# Altium project UZ_A_MAX11331.PrjPCB (part 2 of 3)

## Sheet Power_Supply_1.SchDoc
size A4; Author: Andreas Geiger; CompanyName: Technische Hochschule Nürnberg Georg Simon Ohm; Organization: UltraZohm; Address1: Kesslerplatz 12; Address2: 90489 Nürnberg; Address3: GERMANY; DocumentNumber: 10; SheetNumber: 10; SheetTotal: 12; Website: www.ultrazohm.com
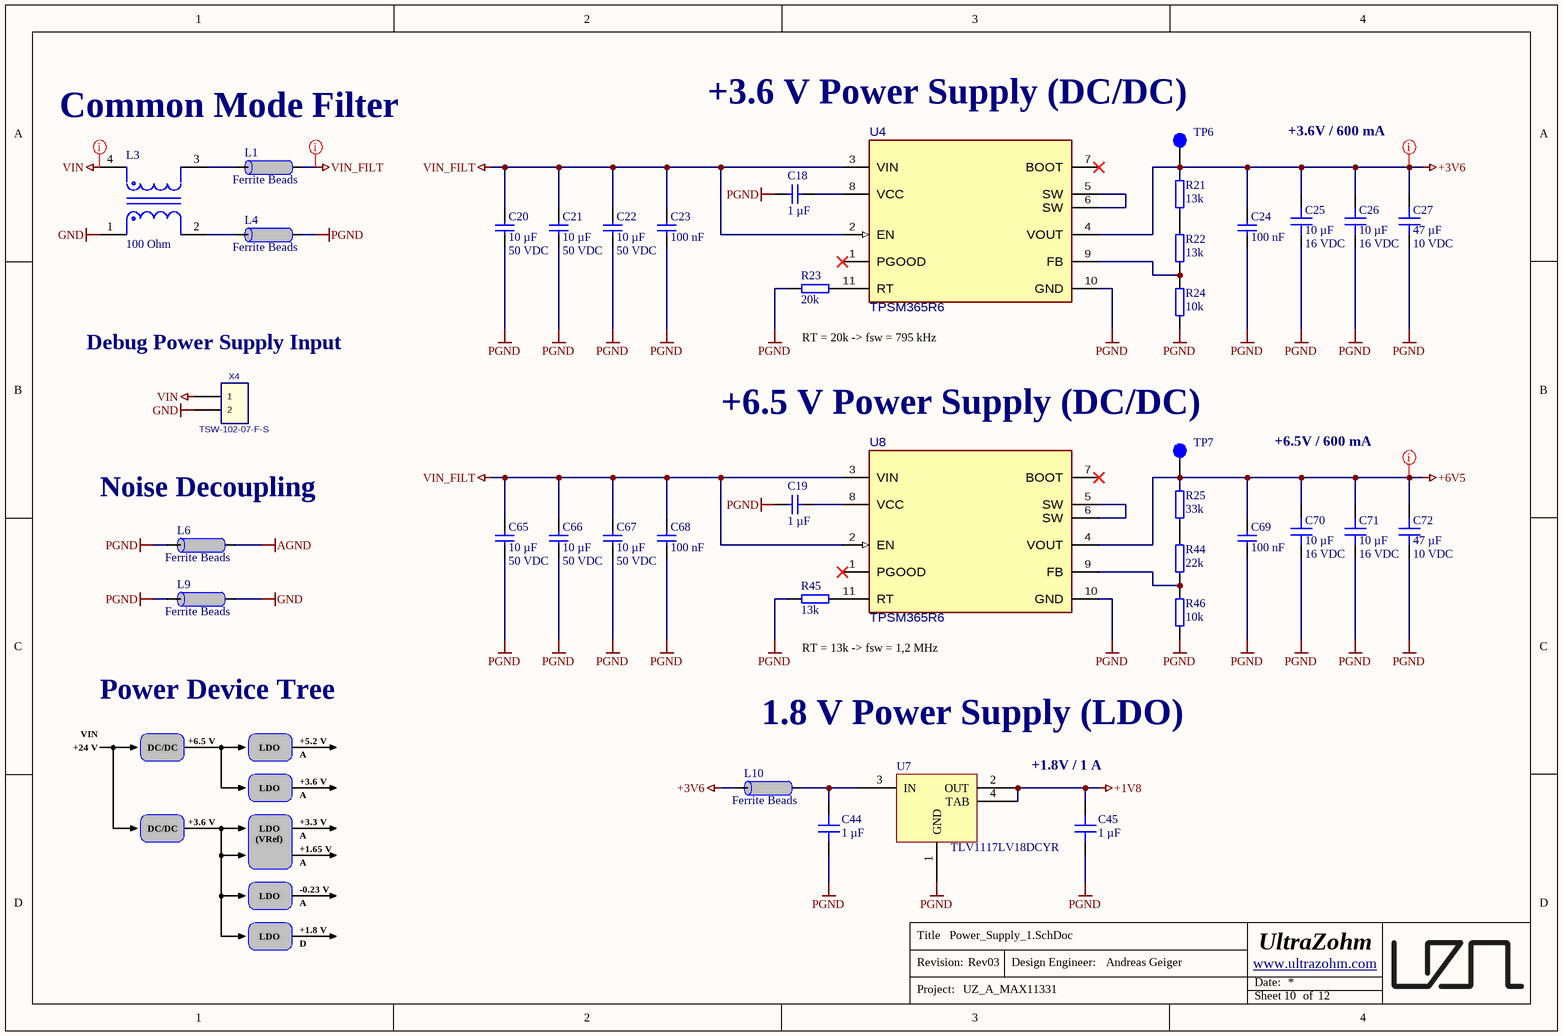
[diagram p7: Power_Supply_1.SchDoc]

### Parts
C18  1 µF  [C_0603_TE]
C19  1 µF  [C_0603_TE]
C20  10 µF  Voltage Rating: 50 VDC  [C_1206_TE]
C21  10 µF  Voltage Rating: 50 VDC  [C_1206_TE]
C22  10 µF  Voltage Rating: 50 VDC  [C_1206_TE]
C23  100 nF  [C_0603_TE]
C24  100 nF  [C_0603_TE]
C25  10 µF  Voltage Rating: 16 VDC  [C_0603_TE]
C26  10 µF  Voltage Rating: 16 VDC  [C_0603_TE]
C27  47 µF  Voltage Rating: 10 VDC  [C_1210_N]
C44  1 µF  [C_0603]
C45  1 µF  [C_0603]
C65  10 µF  Voltage Rating: 50 VDC  [C_1206_TE]
C66  10 µF  Voltage Rating: 50 VDC  [C_1206_TE]
C67  10 µF  Voltage Rating: 50 VDC  [C_1206_TE]
C68  100 nF  [C_0603_TE]
C69  100 nF  [C_0603_TE]
C70  10 µF  Voltage Rating: 16 VDC  [C_0603_TE]
C71  10 µF  Voltage Rating: 16 VDC  [C_0603_TE]
C72  47 µF  Voltage Rating: 10 VDC  [C_1210_N]
L1  Component Type: Ferrite Beads  [INDC2012X92N_V]  (hidden comment: UPZ2012E601-2R0TF)
L3  100 Ohm  [FP-DLW5BT-MFG]
L4  Component Type: Ferrite Beads  [INDC2012X92N_V]  (hidden comment: UPZ2012E601-2R0TF)
L6  Component Type: Ferrite Beads  [INDC2012X92N_V]  (hidden comment: UPZ2012E601-2R0TF)
L9  Component Type: Ferrite Beads  [INDC2012X92N_V]  (hidden comment: UPZ2012E601-2R0TF)
L10  Component Type: Ferrite Beads  [INDC2012X92N_V]  (hidden comment: UPZ2012E601-2R0TF)
R21  13k  [R_0402_TE]
R22  13k  [R_0402_TE]
R23  20k  [R_0402_TE]
R24  10k  [R_0402_TE]
R25  33k  [R_0402_TE]
R44  22k  [R_0402_TE]
R45  13k  [R_0402_TE]
R46  10k  [R_0402_TE]
TP6  Testpoint 1mm  [TP_1mm]  (value not drawn)  (no BOM)
TP7  Testpoint 1mm  [TP_1mm]  (value not drawn)  (no BOM)
U4  TPSM365R6  [RDN0011A-MFG]
U7  TLV1117LV18DCYR  [SOT230P700X170-4N]
U8  TPSM365R6  [RDN0011A-MFG]
X4  TSW-102-07-F-S  [TSW-102-XX-XXX-S]

### Nets
+1V8: C45.2 U7.2(OUT) U7.4(TAB)
+3V6: C24.2 C25.2 C26.2 C27.2 L10.2 R21.2 TP6.1 U4.4(VOUT)
+6V5: C69.2 C70.2 C71.2 C72.2 R25.2 TP7.1 U8.4(VOUT)
AGND: L6.1
GND: L3.1 L9.1 X4.2
PGND: C18.1 C19.1 C20.2 C21.2 C22.2 C23.1 C24.1 C25.1 C26.1 C27.1 C44.1 C45.1 C65.1 C66.1 C67.1 C68.1 C69.1 C70.1 C71.1 C72.1 L4.1 L6.2 L9.2 R23.1 R24.1 R45.1 R46.1 U4.10(GND) U7.1(GND) U8.10(GND)
VIN: L3.4 X4.1
VIN_FILT: C20.1 C21.1 C22.1 C23.2 C65.2 C66.2 C67.2 C68.2 L1.1 U4.2(EN) U4.3(VIN) U8.2(EN) U8.3(VIN)
NetC18_2: C18.2 U4.8(VCC)
NetC19_2: C19.2 U8.8(VCC)
NetC44_2: C44.2 L10.1 U7.3(IN)
NetL1_2: L1.2 L3.3
NetL3_2: L3.2 L4.2
NetR21_1: R21.1 R22.2
NetR22_1: R22.1 R24.2 U4.9(FB)
NetR23_2: R23.2 U4.11(RT)
NetR25_1: R25.1 R44.2
NetR44_1: R44.1 R46.2 U8.9(FB)
NetR45_2: R45.2 U8.11(RT)
NetU4_5: U4.5(SW) U4.6(SW)
NetU8_5: U8.5(SW) U8.6(SW)

Not connected (* = marked no-connect by the designer): U4 1(PGOOD)* 7(BOOT)*; U8 1(PGOOD)* 7(BOOT)*

### Layout directives
net class PWR: +3V6, +6V5, VIN, VIN_FILT

### Notes on the sheet
- (near TP6) +3.6 V Power Supply (DC/DC)
- Common Mode Filter
- +3.6V / 600 mA
- (near X4) Debug Power Supply Input
- RT = 20k -> fsw = 795 kHz
- (near TP7) +6.5 V Power Supply (DC/DC)
- +6.5V / 600 mA
- Noise Decoupling
- Power Device Tree
- RT = 13k -> fsw = 1,2 MHz
- +24 V
- VIN
- DC/DC
- +6.5 V
- LDO
- +5.2 V
- +3.6 V
- A
- 1.8 V Power Supply (LDO)
- +1.8V / 1 A
- (VRef)
- +1.65 V
- +3.3 V
- -0.23 V
- +1.8 V
- D
- Title
- Revision:
- Design Engineer:
- Date:
- Project:
- Sheet
- of

### Library data of the parts
C18 C19 = UZgen_C_0603_1uF_16V_X7R: Generic capacitor; Manufacturer: UZgen; Voltage: 16V; Tolerance: 10 %; Created from: UZgenTool; Technology: X7R; Value: 1 µF; Manufacturer Part Number: UZgen_C_0603_1uF_16V_X7R; PartID: 3783; Created On: 02.08.2024 11:17:59; Device Package: 0603; Mounting Type: SMD; Last Updated: 02.08.2024 11:17:59
C20-C22 C65-C67 = CL31B106KBHNNNE: 50V 10uF X7R ±10% 1206  Multilayer Ceramic Capacitors MLCC - SMD/SMT ROHS; Manufacturer: Samsung Electro-Mechanics; Created from: AGeiger; Manufacturer Part Number: CL31B106KBHNNNE; PartID: 107; Created On: 20.09.2022 20:14:50; ComponentLink1Description: Datasheet; ComponentLink1URL: https://datasheet.lcsc.com/lcsc/1810221111_Samsung-Electro-Mechanics-CL31B106KBHNNNE_C89632.pdf; Component Type: Capacitor 1206; Device Package: 1206; Last Updated: 08.08.2024 12:57:34; Mounting Type: SMD; Operating Temperature: -55 - 125°C; Series: X7R; Supplier 1: LCSC; Supplier Part Number 1: C89632; Type: Capacitor; Tolerance: 10 %; Value: 10 µF; Live Cycle Status: 1; LCSC Part Number: C89632; Supplier 2: Mouser; Supplier Part Number 2: 187-CL31B106KBHNNNE
C23 C24 C68 C69 = UZgen_C_0603_100nF_50V_X7R: as C82 on sheet CarrierConnector; Manufacturer Part Number: UZgen_C_0603_100nF_50V_X7R; PartID: 1; Created On: 02.07.2024 14:42:23; Device Package: 0603; Last Updated: 08.08.2024 15:01:15; Mounting Type: SMD; Value: 100 nF; Technology: X7R
C25 C26 C70 C71 = CL10A106MO8NQNC: Capacitor 0603, 16 VDC, 10 µF, X5R; Manufacturer: Samsung Electro-Mechanics; Tolerance: 20 %; Created from: AGeiger; Manufacturer Part Number: CL10A106MO8NQNC; PartID: 101; Created On: 22.08.2022 13:56:44; ComponentLink1Description: Datasheet; ComponentLink1URL: https://datasheet.lcsc.com/lcsc/1810261909_Samsung-Electro-Mechanics-CL10A106MO8NQNC_C92487.pdf; Component Type: Capacitor 0603; Device Package: 0603; Last Updated: 19.11.2024 12:34:06; Mounting Type: SMD; Operating Temperature: -55 - 85°C; Supplier 1: LCSC; Supplier Part Number 1: C92487; Type: Capacitor; Value: 10 µF; Live Cycle Status: 1; LCSC Part Number: C92487; Series: X5R
C27 C72 = GRM32ER71A476KE15L: 10V 47uF X7R ±10% 1210  Multilayer Ceramic Capacitors MLCC - SMD/SMT ROHS; Manufacturer: Murata Electronics; Created from: AGeiger; Manufacturer Part Number: GRM32ER71A476KE15L; PartID: 111; Created On: 21.09.2022 16:18:50; ComponentLink1Description: Datasheet; ComponentLink1URL: https://datasheet.lcsc.com/lcsc/1811071031_Murata-Electronics-GRM32ER71A476KE15L_C84494.pdf; Component Type: Capacitor 1210; Device Package: 1210; Last Updated: 21.09.2022 16:18:50; Mounting Type: SMD; Operating Temperature: -55 - 125°C; Series: GRM; Supplier 1: LCSC; Supplier Part Number 1: C84494; Type: Capacitor; Tolerance: 10 %; Value: 47 µF; Live Cycle Status: 1; LCSC Part Number: C84494
C44 C45 = UMK107AB7105KA-T: 50V 1uF X7R ±10% 0603 Multilayer Ceramic Capacitors MLCC - SMD/SMT ROHS; Manufacturer: Taiyo Yuden; Voltage Rating: 50 VDC; Created from: NDiringer; Manufacturer Part Number: UMK107AB7105KA-T; PartID: 98; Created On: 09.08.2022 09:35:02; ComponentLink1Description: Datasheet; ComponentLink1URL: https://www.mouser.de/datasheet/2/396/mlcc02_e-1307760.pdf; Component Type: Capacitor 0603; Device Package: 0603; Last Updated: 21.09.2022 16:11:37; Mounting Type: SMD; Operating Temperature: -55 - 125°C; Series: X7R; Supplier 1: LCSC; Supplier Part Number 1: C105174; Supplier 2: Mouser; Supplier Part Number 2: 963-UMK107AB7105MA-T; Type: Capacitor; Tolerance: 10 %; Value: 1 µF; Live Cycle Status: 1; LCSC Part Number: C105174; Stock number: not stored
L1 L4 L6 L9 L10 = UPZ2012E601-2R0TF: 2A 1 90mΩ 600Ω@100MHz ±25% 0805  Ferrite Beads ROHS; Manufacturer: Sunlord; Value: 90 Ohm; Created from: AGeiger; Manufacturer Part Number: UPZ2012E601-2R0TF; PartID: 11; Created On: 03.09.2022 16:57:01; ComponentLink1Description: Datasheet; ComponentLink1URL: https://datasheet.lcsc.com/lcsc/2110091730_Sunlord-UPZ2012E601-2R0TF_C98308.pdf; Device Package: 0805; Last Updated: 03.09.2022 17:01:04; Mounting Type: SMD; Operating Temperature: -55 - 125 °C; Supplier 1: LCSC; Supplier Part Number 1: C98308; Type: Ferrite Bead; DC current: 2 A; Live Cycle Status: 1; LCSC Part Number: C98308
L3 = DLW5BTH142TQ2L: -40℃~125℃ 1.5A 56mΩ 50V 100Ω @ 10MHz 125VDC SMD,5x5mm Common Mode Filters ROHS; Manufacturer: Murata; Type: Common Mode Choke; Created from: AGeiger; Manufacturer Part Number: DLW5BTH142TQ2L; PartID: 13; Created On: 18.10.2022 16:07:46; ComponentLink1Description: Datasheet; ComponentLink1URL: https://datasheet.lcsc.com/lcsc/1912111437_Murata-Electronics-DLW5BTH142TQ2L_C393166.pdf; Component Type: Common Mode Choke; Device Package: SMD,5x5mm; Last Updated: 14.08.2025 08:46:24; Mounting Type: SMD; Operating Temperature: -40 to +125 °C; Series: DLW; Supplier 1: LCSC; Supplier Part Number 1: C393166; DC current: 1.5A; Value: 100 Ohm; Live Cycle Status: 1; LCSC Part Number: C393166
R21 R22 R45 = UZgen_R_0402_13k: Generic resistor; Manufacturer: UZgen; Tolerance: 1 %; Created from: UZgenTool; Manufacturer Part Number: UZgen_R_0402_13k; PartID: 104; Created On: 02.07.2024 17:29:46; Value: 13k; Device Package: 0402; Mounting Type: SMD; Last Updated: 02.07.2024 17:29:46
R23 = UZgen_R_0402_20k: Generic resistor; Manufacturer: UZgen; Tolerance: 1 %; Created from: UZgenTool; Manufacturer Part Number: UZgen_R_0402_20k; PartID: 108; Created On: 02.07.2024 17:29:46; Value: 20k; Device Package: 0402; Mounting Type: SMD; Last Updated: 02.07.2024 17:29:46
R24 R46 = UZgen_R_0402_10k: Generic resistor; Manufacturer: UZgen; Tolerance: 1 %; Created from: UZgenTool; Manufacturer Part Number: UZgen_R_0402_10k; PartID: 101; Created On: 02.07.2024 17:29:46; Value: 10k; Device Package: 0402; Mounting Type: SMD; Last Updated: 02.07.2024 17:29:46
R25 = UZgen_R_0402_33k: Generic resistor; Manufacturer: UZgen; Tolerance: 1 %; Created from: UZgenTool; Manufacturer Part Number: UZgen_R_0402_33k; PartID: 113; Created On: 02.07.2024 17:29:47; Value: 33k; Device Package: 0402; Mounting Type: SMD; Last Updated: 02.07.2024 17:29:47
R44 = UZgen_R_0402_22k: Generic resistor; Manufacturer: UZgen; Tolerance: 1 %; Created from: UZgenTool; Manufacturer Part Number: UZgen_R_0402_22k; PartID: 109; Created On: 02.07.2024 17:29:46; Value: 22k; Device Package: 0402; Mounting Type: SMD; Last Updated: 02.07.2024 17:29:46
TP6 TP7 = Testpoint_1mm: Manufacturer: UltraZohm; Created from: AGeiger; Created: 2018_06_25_AGeiger; Value: Testpoint 1mm; Manufacturer Part Number: Testpoint_1mm; PartID: 9; Created On: 20.09.2022 13:14:57; Component Type: Testpoint; Last Updated: 14.08.2025 11:47:07; Supplier 1: NULL; Supplier Part Number 1: NULL; Type: Testpoint; Live Cycle Status: 1
U4 U8 = TPSM365R6FRDNR: 3-V to 65-V input, 1-V to 13-V output, 0.6-A synchronous buck converter power module; Manufacturer: Texas Instruments; Created from: AGeiger; Manufacturer Part Number: TPSM365R6FRDNR; PartID: 42; Created On: 16.06.2025 17:12:20; ComponentLink1Description: Datasheet; ComponentLink1URL: https://www.ti.com/lit/ds/symlink/tpsm365r3.pdf?ts=1747982141267; Component Type: Power module with inductor; Device Package: QFN-FCMOD; Last Updated: 26.09.2025 12:26:17; Mounting Type: SMD; Operating Temperature: -40 to +125 °C; Series: TPSM365; Supplier 1: LCSC; Supplier Part Number 1: C6723000; Type: Power module (integrated inductor); Value: TPSM365R6; Live Cycle Status: 1; LCSC Part Number: C6723000; Stock number: not stored; Supplier 2: Mouser; Supplier Part Number 2: 595-TPSM365R6FRDNR
U7 = TLV1117LV18DCYR: 1-A, Positive Fixed-Voltage, Low-Dropout Regulator; MF: Texas Instruments; Voltage Output: 1.8 V; Voltage Input Max: 5.5 V; Current Max: 1 A; Value: 1.8V; Created from: AGeiger; MPN: TLV1117LV18DCYR; Supplier 1: LCSC; Supplier Part Number 1: C80105; Manufacturer Part Number: TLV1117LV18DCYR; PartID: 23; Created On: 28.11.2022 16:53:03; ComponentLink1Description: Datasheet; ComponentLink1URL: https://www.ti.com/lit/ds/symlink/tlv1117lv.pdf?HQS=dis-mous-null-mousermode-dsf-pf-null-wwe&ts=1669592607754&ref_url=https%253A%252F%252Fwww.mouser.de%252F; Component Type: Low Dropout Regulator; Device Package: SOT-223; Last Updated: 28.11.2022 16:53:03; Manufacturer: Texas Instruments; Mounting Type: SMD; Operating Temperature: -40 to +125 °C; Type: Low Dropout Regulator; Live Cycle Status: 1; LCSC Part Number: C80105; Stock number: not stored
X4 = TSW-102-07-F-S: Pin Header, 2.54mm, 2x1; MANUFACTURER: SAMTEC; Created from: AGeiger; Number of positions: 2; CREATED BY: May 18, 2016 - Wendy Xin; PCB DECAL: TSW-102-XX-XXX-S; Manufacturer Part Number: TSW-102-07-F-S; PartID: 13; Created On: 02.12.2022 15:20:24; ComponentLink1Description: Datasheet; ComponentLink1URL: https://suddendocs.samtec.com/catalog_english/tsw_th.pdf; Component Type: Pin Header; Device Package: THT; Last Updated: 02.12.2022 15:20:30; Mounting Type: THT; Operating Temperature: -55 to +125 °C; Series: TSW; Supplier 1: Mouser; Supplier Part Number 1: 200-TSW10207FS; Type: Pin Header; Live Cycle Status: 1; Stock number: not stored; Number of rows: 1

## Sheet ADC_Signal_Distribution.SchDoc
size A4; Author: Andreas Geiger; CompanyName: Technische Hochschule Nürnberg Georg Simon Ohm; Organization: UltraZohm; Address1: Kesslerplatz 12; Address2: 90489 Nürnberg; Address3: GERMANY; DocumentNumber: 8; SheetNumber: 8; SheetTotal: 12; Website: www.ultrazohm.com
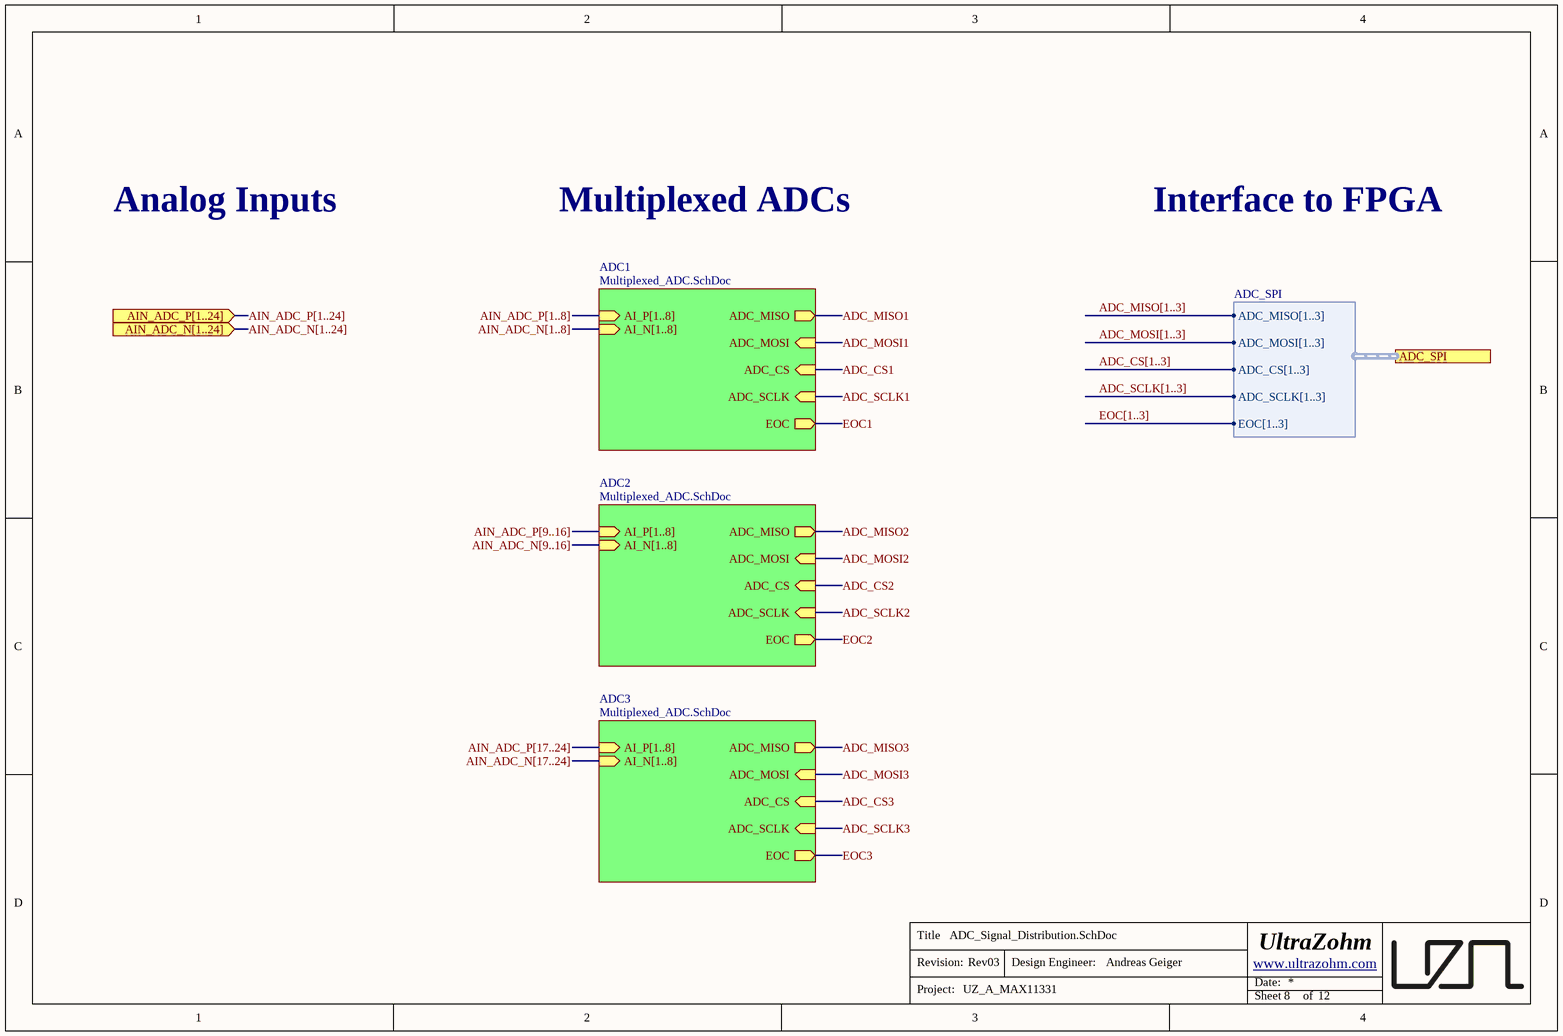
[diagram p8: ADC_Signal_Distribution.SchDoc]

### Sub-sheets
ADC1 = Multiplexed_ADC.SchDoc: ADC_MOSI (in), ADC_CS (in), ADC_SCLK (in), ADC_MISO (out), AI_P[1..8] (in), AI_N[1..8] (in), EOC (out)
ADC2 = Multiplexed_ADC.SchDoc: ADC_MOSI (in), ADC_CS (in), ADC_SCLK (in), ADC_MISO (out), AI_P[1..8] (in), AI_N[1..8] (in), EOC (out)
ADC3 = Multiplexed_ADC.SchDoc: ADC_MOSI (in), ADC_CS (in), ADC_SCLK (in), ADC_MISO (out), AI_P[1..8] (in), AI_N[1..8] (in), EOC (out)

### Ports
ADC_SPI (harness ADC_SPI), AIN_ADC_N[1..24] (in), AIN_ADC_P[1..24] (in)

### Harnesses
ADC_SPI: ADC_MISO[1..3], ADC_MOSI[1..3], ADC_CS[1..3], ADC_SCLK[1..3], EOC[1..3]

### Buses and harness runs
bus ADC_CS[1..3]
bus ADC_MISO[1..3]
bus ADC_MOSI[1..3]
bus ADC_SCLK[1..3]
bus AIN_ADC_N[1..8] = sheet ADC1/AI_N[1..8]
bus AIN_ADC_N[1..24] = port AIN_ADC_N[1..24]
bus AIN_ADC_N[9..16] = sheet ADC2/AI_N[1..8]
bus AIN_ADC_N[17..24] = sheet ADC3/AI_N[1..8]
bus AIN_ADC_P[1..8] = sheet ADC1/AI_P[1..8]
bus AIN_ADC_P[1..24] = port AIN_ADC_P[1..24]
bus AIN_ADC_P[9..16] = sheet ADC2/AI_P[1..8]
bus AIN_ADC_P[17..24] = sheet ADC3/AI_P[1..8]
bus EOC[1..3]

### Notes on the sheet
- Analog Inputs
- Multiplexed ADCs
- Interface to FPGA
- Title
- Revision:
- Design Engineer:
- Date:
- Project:
- Sheet
- of

## Sheet Multiplexed_ADC.SchDoc
size A4; Author: Andreas Geiger; CompanyName: Technische Hochschule Nürnberg Georg Simon Ohm; Organization: UltraZohm; Address1: Kesslerplatz 12; Address2: 90489 Nürnberg; Address3: GERMANY; DocumentNumber: 9; SheetNumber: 9; SheetTotal: 12; Website: www.ultrazohm.com
Used 3 times, as channels U_ADC_Signal_Distribution/ADC1, U_ADC_Signal_Distribution/ADC2, U_ADC_Signal_Distribution/ADC3. Parts and nets are listed once, with the designators drawn on the sheet.
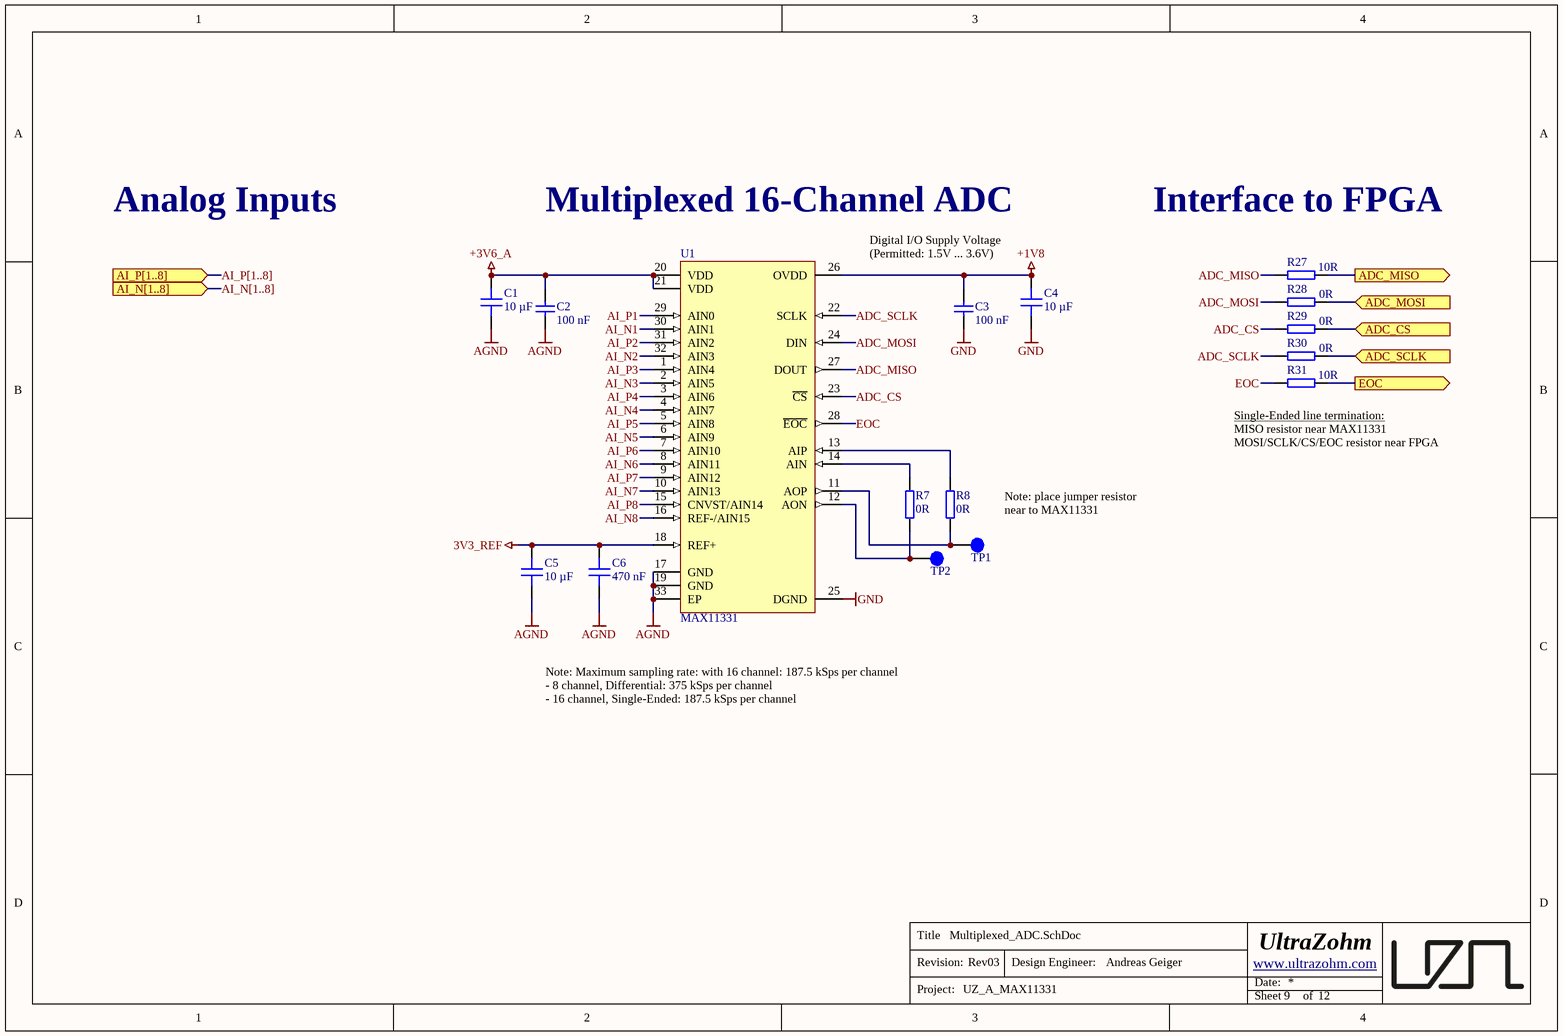
[diagram p9: Multiplexed_ADC.SchDoc]

### Parts
C1  10 µF  [C_0603_TE]
C2  100 nF  [C_0603_TE]
C3  100 nF  [C_0603_TE]
C4  10 µF  [C_0603_TE]
C5  10 µF  [C_0603_TE]
C6  470 nF  [C_0603]
R7  0R  [R_0603_TE]
R8  0R  [R_0603_TE]
R27  10R  [R_0402_TE]
R28  0R  [R_0402_TE]
R29  0R  [R_0402_TE]
R30  0R  [R_0402_TE]
R31  10R  [R_0402_TE]
TP1  Testpoint 1mm  [TP_1mm]  (value not drawn)  (no BOM)
TP2  Testpoint 1mm  [TP_1mm]  (value not drawn)  (no BOM)
U1  MAX11331  [QFN50P500X500X80-33N-310]

### Ports
ADC_CS (in), ADC_MISO (out), ADC_MOSI (in), ADC_SCLK (in), AI_N[1..8] (in), AI_P[1..8] (in), EOC (out)

### Nets
3V3_REF: C5.2 C6.2 U1.18(REF+)
+1V8: C3.2 C4.2 U1.26(OVDD)
+3V6_A: C1.2 C2.2 U1.20(VDD) U1.21(VDD)
AGND: C1.1 C2.1 C5.1 C6.1 U1.17(GND) U1.19(GND) U1.33(EP)
GND: C3.1 C4.1 U1.25(DGND)
ADC_CS: R29.1 U1.23(~{CS})
ADC_CS: R29.2 ; port ADC_CS  [a separate net that carries the same name]
ADC_MISO: R27.1 U1.27(DOUT)
ADC_MISO: R27.2 ; port ADC_MISO  [a separate net that carries the same name]
ADC_MOSI: R28.1 U1.24(DIN)
ADC_MOSI: R28.2 ; port ADC_MOSI  [a separate net that carries the same name]
ADC_SCLK: R30.1 U1.22(SCLK)
ADC_SCLK: R30.2 ; port ADC_SCLK  [a separate net that carries the same name]
AI_N1: U1.30(AIN1)
AI_N2: U1.32(AIN3)
AI_N3: U1.2(AIN5)
AI_N4: U1.4(AIN7)
AI_N5: U1.6(AIN9)
AI_N6: U1.8(AIN11)
AI_N7: U1.10(AIN13)
AI_N8: U1.16(REF-/AIN15)
AI_P1: U1.29(AIN0)
AI_P2: U1.31(AIN2)
AI_P3: U1.1(AIN4)
AI_P4: U1.3(AIN6)
AI_P5: U1.5(AIN8)
AI_P6: U1.7(AIN10)
AI_P7: U1.9(AIN12)
AI_P8: U1.15(CNVST/AIN14)
EOC: R31.1 U1.28(~{EOC})
EOC: R31.2 ; port EOC  [a separate net that carries the same name]
NetR7_1: R7.1 TP2.1 U1.12(AON)
NetR7_2: R7.2 U1.14(AIN)
NetR8_1: R8.1 TP1.1 U1.11(AOP)
NetR8_2: R8.2 U1.13(AIP)

### Channels
U_ADC_Signal_Distribution/ADC1: designators end in A; ports ADC_CS=ADC_CS1 ADC_MISO=ADC_MISO1 ADC_MOSI=ADC_MOSI1 ADC_SCLK=ADC_SCLK1 EOC=EOC1
U_ADC_Signal_Distribution/ADC2: designators end in B; ports ADC_CS=ADC_CS2 ADC_MISO=ADC_MISO2 ADC_MOSI=ADC_MOSI2 ADC_SCLK=ADC_SCLK2 EOC=EOC2
U_ADC_Signal_Distribution/ADC3: designators end in C; ports ADC_CS=ADC_CS3 ADC_MISO=ADC_MISO3 ADC_MOSI=ADC_MOSI3 ADC_SCLK=ADC_SCLK3 EOC=EOC3

### Buses and harness runs
bus AI_N[1..8] = port AI_N[1..8]
bus AI_P[1..8] = port AI_P[1..8]

### Notes on the sheet
- Analog Inputs
- Multiplexed 16-Channel ADC
- Digital I/O Supply Voltage
- Interface to FPGA
- (Permitted: 1.5V ... 3.6V)
- (near R31) Single-Ended line termination:
- (near R31) MISO resistor near MAX11331
- MOSI/SCLK/CS/EOC resistor near FPGA
- Note: place jumper resistor
- near to MAX11331
- Note: Maximum sampling rate: with 16 channel: 187.5 kSps per channel
- - 16 channel, Single-Ended: 187.5 kSps per channel
- - 8 channel, Differential: 375 kSps per channel
- Title
- Revision:
- Design Engineer:
- Date:
- Project:
- Sheet
- of

### Library data of the parts
C1 C4 C5 = CL10A106MO8NQNC: Capacitor 0603, 16 VDC, 10 µF, X5R; Manufacturer: Samsung Electro-Mechanics; Tolerance: 20 %; Voltage Rating: 16 VDC; Created from: AGeiger; Manufacturer Part Number: CL10A106MO8NQNC; PartID: 101; Created On: 22.08.2022 13:56:44; ComponentLink1Description: Datasheet; ComponentLink1URL: https://datasheet.lcsc.com/lcsc/1810261909_Samsung-Electro-Mechanics-CL10A106MO8NQNC_C92487.pdf; Component Type: Capacitor 0603; Device Package: 0603; Last Updated: 19.11.2024 12:34:06; Mounting Type: SMD; Operating Temperature: -55 - 85°C; Supplier 1: LCSC; Supplier Part Number 1: C92487; Type: Capacitor; Value: 10 µF; Live Cycle Status: 1; LCSC Part Number: C92487; Series: X5R
C2 C3 = UZgen_C_0603_100nF_50V_X7R: as C82 on sheet CarrierConnector; Manufacturer Part Number: UZgen_C_0603_100nF_50V_X7R; PartID: 1; Created On: 02.07.2024 14:42:23; Device Package: 0603; Last Updated: 08.08.2024 15:01:15; Mounting Type: SMD; Value: 100 nF; Technology: X7R
C6 = CL10A474KB8NNNC: Capacitor 0603, 50 VDC, 470 nF, X5R; Manufacturer: Samsung Electro-Mechanics; Tolerance: 10 %; Voltage Rating: 50 VDC; Created from: AGeiger; Manufacturer Part Number: CL10A474KB8NNNC; PartID: 103; Created On: 22.08.2022 14:44:45; ComponentLink1Description: Datasheet; ComponentLink1URL: https://datasheet.lcsc.com/lcsc/1810191213_Samsung-Electro-Mechanics-CL10A474KB8NNNC_C170149.pdf; Component Type: Capacitor 0603; Device Package: 0603; Last Updated: 22.08.2022 14:44:45; Mounting Type: SMD; Operating Temperature: -55 - 85°C; Supplier 1: LCSC; Supplier Part Number 1: C170149; Supplier 2: Mouser; Supplier Part Number 2: 187-CL10A474KB8NNNC; Type: Capacitor; Value: 470 nF; Live Cycle Status: 1; LCSC Part Number: C170149
R7 R8 = UZgen_R_0603_0R: Generic resistor; Manufacturer: UZgen; Tolerance: 1 %; Created from: UZgenTool; Manufacturer Part Number: UZgen_R_0603_0R; PartID: 581; Created On: 08.07.2024 14:34:30; Value: 0R; Device Package: 0603; Mounting Type: SMD; Last Updated: 08.07.2024 14:34:30
R27 R31 = UZgen_R_0402_10R: Generic resistor; Manufacturer: UZgen; Tolerance: 1 %; Created from: UZgenTool; Manufacturer Part Number: UZgen_R_0402_10R; PartID: 29; Created On: 02.07.2024 17:29:44; Device Package: 0402; Last Updated: 02.07.2024 17:29:44; Mounting Type: SMD; Value: 10R
R28-R30 = UZgen_R_0402_0R: Generic resistor; Manufacturer: UZgen; Tolerance: 1 %; Created from: UZgenTool; Manufacturer Part Number: UZgen_R_0402_0R; PartID: 580; Created On: 08.07.2024 14:34:30; Device Package: 0402; Last Updated: 08.07.2024 14:34:30; Mounting Type: SMD; Value: 0R
TP1 TP2 = Testpoint_1mm: as TP6 on sheet Power_Supply_1; Created: 2018_06_25_AGeiger; Value: Testpoint 1mm; Manufacturer Part Number: Testpoint_1mm; PartID: 9; Created On: 20.09.2022 13:14:57; Component Type: Testpoint; Last Updated: 14.08.2025 11:47:07; Supplier 1: NULL; Supplier Part Number 1: NULL; Type: Testpoint; Live Cycle Status: 1
U1 = MAX11331ATJ+: 3Msps, 12-/10-Bit, 8-/16-Channel ADCs with Post-Mux External Signal Conditioning Access; Manufacturer: Maxim Integrated; Channels: 16; Resolution: 12 bit; Created from: AGeiger; Manufacturer Part Number: MAX11331ATJ+; PartID: 4; Created On: 25.08.2022 14:24:25; ComponentLink1Description: Datasheet; ComponentLink1URL: https://datasheets.maximintegrated.com/en/ds/MAX11329-MAX11332.pdf; Component Type: ADC; Device Package: TQFN-32 EP; Last Updated: 25.08.2022 14:27:33; Mounting Type: SMD; Operating Temperature: -40 - 125 °C; Supplier 1: Mouser; Supplier Part Number 1: 700-MAX11331ATJ+; Type: ADC; Value: MAX11331; Live Cycle Status: 1; LCSC Part Number: C1543252

## Sheet Power_Supply_2.SchDoc
size A4; Author: Andreas Geiger; CompanyName: Technische Hochschule Nürnberg Georg Simon Ohm; Organization: UltraZohm; Address1: Kesslerplatz 12; Address2: 90489 Nürnberg; Address3: GERMANY; DocumentNumber: 11; SheetNumber: 11; SheetTotal: 12; Website: www.ultrazohm.com
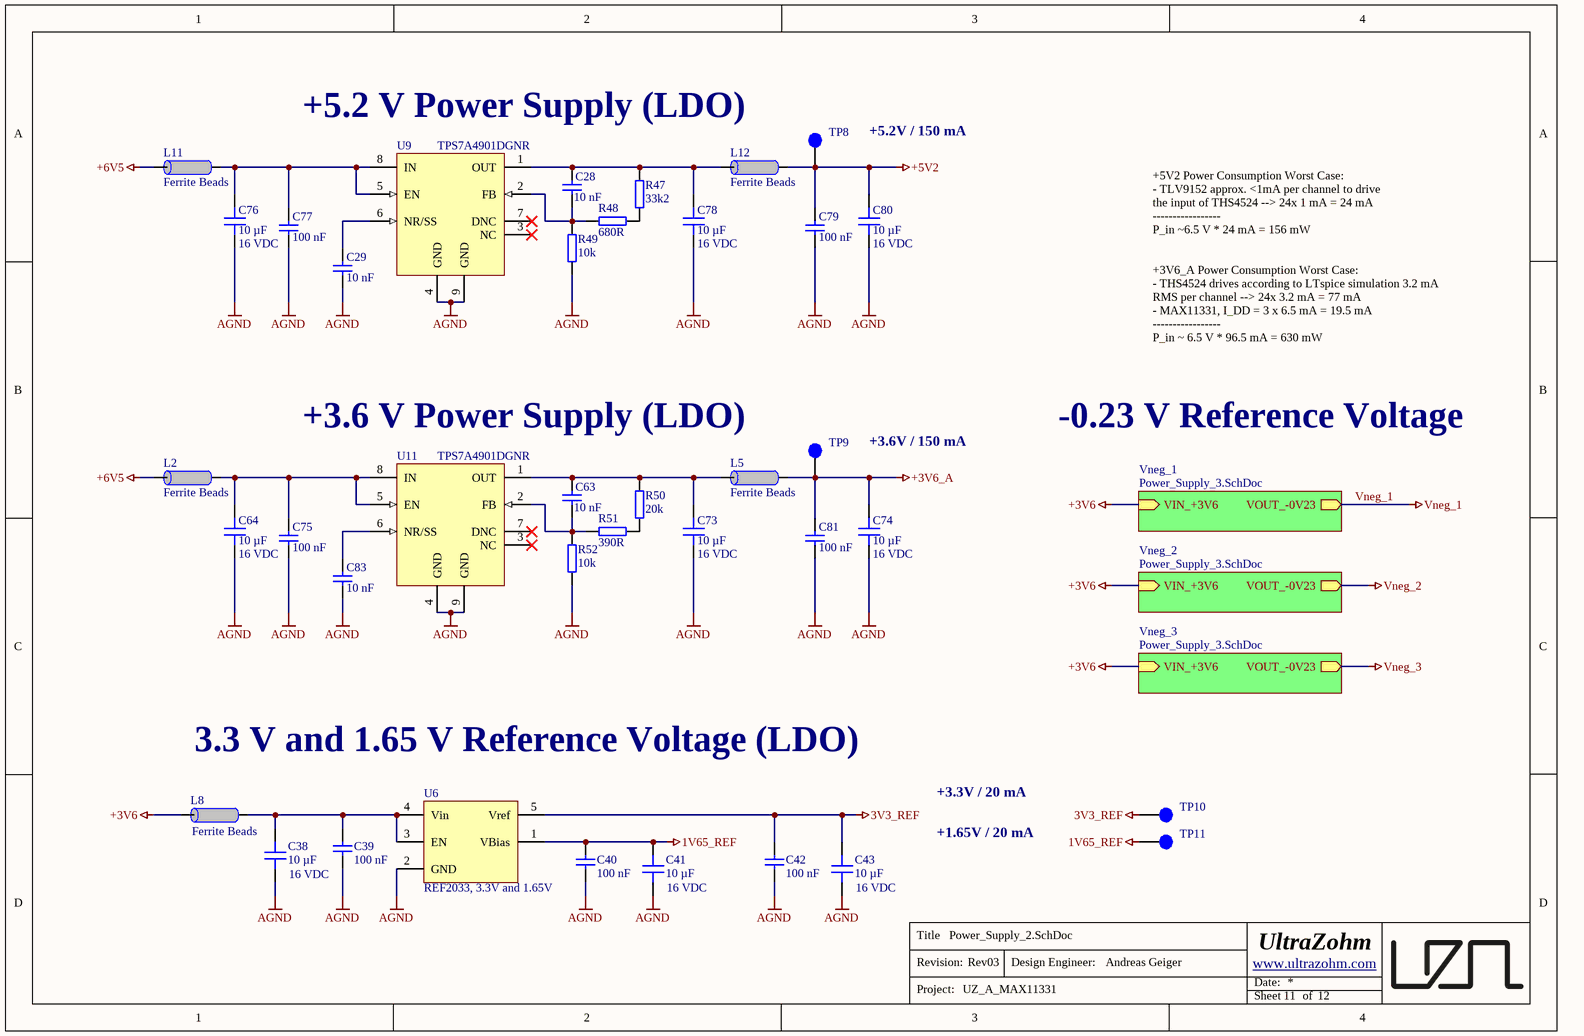
[diagram p10: Power_Supply_2.SchDoc]

### Parts
C28  10 nF  [C_0402_TE]
C29  10 nF  [C_0402_TE]
C38  10 µF  Voltage Rating: 16 VDC  [C_0603_TE]
C39  100 nF  [C_0603_TE]
C40  100 nF  [C_0603_TE]
C41  10 µF  Voltage Rating: 16 VDC  [C_0603_TE]
C42  100 nF  [C_0603_TE]
C43  10 µF  Voltage Rating: 16 VDC  [C_0603_TE]
C63  10 nF  [C_0402_TE]
C64  10 µF  Voltage Rating: 16 VDC  [C_0603_TE]
C73  10 µF  Voltage Rating: 16 VDC  [C_0603_TE]
C74  10 µF  Voltage Rating: 16 VDC  [C_0603_TE]
C75  100 nF  [C_0603_TE]
C76  10 µF  Voltage Rating: 16 VDC  [C_0603_TE]
C77  100 nF  [C_0603_TE]
C78  10 µF  Voltage Rating: 16 VDC  [C_0603_TE]
C79  100 nF  [C_0603_TE]
C80  10 µF  Voltage Rating: 16 VDC  [C_0603_TE]
C81  100 nF  [C_0603_TE]
C83  10 nF  [C_0402_TE]
L2  Component Type: Ferrite Beads  [INDC2012X92N_V]  (hidden comment: UPZ2012E601-2R0TF)
L5  Component Type: Ferrite Beads  [INDC2012X92N_V]  (hidden comment: UPZ2012E601-2R0TF)
L8  Component Type: Ferrite Beads  [INDC2012X92N_V]  (hidden comment: UPZ2012E601-2R0TF)
L11  Component Type: Ferrite Beads  [INDC2012X92N_V]  (hidden comment: UPZ2012E601-2R0TF)
L12  Component Type: Ferrite Beads  [INDC2012X92N_V]  (hidden comment: UPZ2012E601-2R0TF)
R47  33k2  [R_0402_TE]
R48  680R  [R_0402_TE]
R49  10k  [R_0402_TE]
R50  20k  [R_0402_TE]
R51  390R  [R_0402_TE]
R52  10k  [R_0402_TE]
TP8  Testpoint 1mm  [TP_1mm]  (value not drawn)  (no BOM)
TP9  Testpoint 1mm  [TP_1mm]  (value not drawn)  (no BOM)
TP10  Testpoint 1mm  [TP_1mm]  (value not drawn)  (no BOM)
TP11  Testpoint 1mm  [TP_1mm]  (value not drawn)  (no BOM)
U6  REF2033, 3.3V and 1.65V  [SOT23-5_N]
U9  TPS7A4901DGNR  [SOP65P490X110-9N]
U11  TPS7A4901DGNR  [SOP65P490X110-9N]

### Sub-sheets
Vneg_1 = Power_Supply_3.SchDoc: VIN_+3V6 (in), VOUT_-0V23 (out)
Vneg_2 = Power_Supply_3.SchDoc: VIN_+3V6 (in), VOUT_-0V23 (out)
Vneg_3 = Power_Supply_3.SchDoc: VIN_+3V6 (in), VOUT_-0V23 (out)

### Nets
1V65_REF: C40.2 C41.2 TP11.1 U6.1(VBias)
3V3_REF: C42.2 C43.2 TP10.1 U6.5(Vref)
+3V6: L8.2 ; sheet Vneg_1/VIN_+3V6, sheet Vneg_2/VIN_+3V6, sheet Vneg_3/VIN_+3V6
+3V6_A: C74.2 C81.2 L5.1 TP9.1
+5V2: C79.2 C80.2 L12.1 TP8.1
+6V5: L2.2 L11.2
AGND: C29.1 C38.1 C39.1 C40.1 C41.1 C42.1 C43.1 C64.1 C73.1 C74.1 C75.1 C76.1 C77.1 C78.1 C79.1 C80.1 C81.1 C83.1 R49.1 R52.1 U6.2(GND) U9.4(GND) U9.9(GND) U11.4(GND) U11.9(GND)
NetC28_1: C28.1 R48.1 R49.2 U9.2(FB)
NetC28_2: C28.2 C78.2 L12.2 R47.2 U9.1(OUT)
NetC29_2: C29.2 U9.6(NR/SS)
NetC38_2: C38.2 C39.2 L8.1 U6.3(EN) U6.4(Vin)
NetC63_1: C63.1 R51.1 R52.2 U11.2(FB)
NetC63_2: C63.2 C73.2 L5.2 R50.2 U11.1(OUT)
NetC64_2: C64.2 C75.2 L2.1 U11.5(EN) U11.8(IN)
NetC76_2: C76.2 C77.2 L11.1 U9.5(EN) U9.8(IN)
NetC83_2: C83.2 U11.6(NR/SS)
NetR47_1: R47.1 R48.2
NetR50_1: R50.1 R51.2

Not connected (* = marked no-connect by the designer): U9 3(NC)* 7(DNC)*; U11 3(NC)* 7(DNC)*

### Notes on the sheet
- +5.2 V Power Supply (LDO)
- +5.2V / 150 mA
- +5V2 Power Consumption Worst Case:
  - TLV9152 approx. <1mA per channel to drive the input of THS4524 --> 24x 1 mA = 24 mA
  -----------------
  P_in ~6.5 V * 24 mA = 156 mW
- +3V6_A Power Consumption Worst Case:
  - THS4524 drives according to LTspice simulation 3.2 mA RMS per channel --> 24x 3.2 mA = 77 mA
  - MAX11331, I_DD = 3 x 6.5 mA = 19.5 mA
  -----------------
  P_in ~ 6.5 V * 96.5 mA = 630 mW
- +3.6 V Power Supply (LDO)
- +3.6V / 150 mA
- -0.23 V Reference Voltage
- 3.3 V and 1.65 V Reference Voltage (LDO)
- +3.3V / 20 mA
- +1.65V / 20 mA
- Title
- Revision:
- Design Engineer:
- Date:
- Project:
- Sheet
- of

### Library data of the parts
C28 C29 C63 C83 = UZgen_C_0402_10nF_50V_NP0: Generic capacitor; Manufacturer: UZgen; Voltage: 50V; Tolerance: 10 %; Created from: UZgenTool; Manufacturer Part Number: UZgen_C_0402_10nF_50V_NP0; PartID: 5709; Created On: 13.12.2024 11:08:46; Value: 10 nF; Device Package: 0402; Technology: NP0; Mounting Type: SMD; Last Updated: 13.12.2024 11:08:46
C38 C41 C43 C64 C73 C74 C76 C78 C80 = CL10A106MO8NQNC: as C25 on sheet Power_Supply_1; Manufacturer Part Number: CL10A106MO8NQNC; PartID: 101; Created On: 22.08.2022 13:56:44; ComponentLink1Description: Datasheet; ComponentLink1URL: https://datasheet.lcsc.com/lcsc/1810261909_Samsung-Electro-Mechanics-CL10A106MO8NQNC_C92487.pdf; Component Type: Capacitor 0603; Device Package: 0603; Mounting Type: SMD; Operating Temperature: -55 - 85°C; Supplier 1: LCSC; Supplier Part Number 1: C92487; Type: Capacitor; Value: 10 µF; Live Cycle Status: 1; LCSC Part Number: C92487; Series: X5R
  C38 C41 C43: Last Updated: 19.11.2024 12:34:06
  C64 C73 C74 C76 C78 C80: Last Updated: 19.11.2024 12:40:46
C39 C40 C42 C75 C77 C79 C81 = UZgen_C_0603_100nF_50V_X7R: as C82 on sheet CarrierConnector; Manufacturer Part Number: UZgen_C_0603_100nF_50V_X7R; PartID: 1; Created On: 02.07.2024 14:42:23; Device Package: 0603; Last Updated: 08.08.2024 15:01:15; Mounting Type: SMD; Value: 100 nF; Technology: X7R
L2 L5 L8 L11 L12 = UPZ2012E601-2R0TF: as L1 on sheet Power_Supply_1; Manufacturer Part Number: UPZ2012E601-2R0TF; PartID: 11; Created On: 03.09.2022 16:57:01; ComponentLink1Description: Datasheet; ComponentLink1URL: https://datasheet.lcsc.com/lcsc/2110091730_Sunlord-UPZ2012E601-2R0TF_C98308.pdf; Device Package: 0805; Last Updated: 03.09.2022 17:01:04; Mounting Type: SMD; Operating Temperature: -55 - 125 °C; Supplier 1: LCSC; Supplier Part Number 1: C98308; Type: Ferrite Bead; DC current: 2 A; Live Cycle Status: 1; LCSC Part Number: C98308
R47 = 0402WGF3322TCE: 62.5mW Thick Film Resistor 50V ±100ppm/℃ ±1% 33.2kΩ 0402 Chip Resistor - Surface Mount ROHS; Manufacturer: UNI-ROYAL; Created from: AGeiger; Value: 33k2; Tolerance: 1%; Manufacturer Part Number: 0402WGF3322TCE; PartID: 369; Created On: 08.08.2024 13:22:47; ComponentLink1Description: Datasheet; ComponentLink1URL: https://www.lcsc.com/datasheet/C122548.pdf; Component Type: SMD resistor; Device Package: 0402; Last Updated: 07.08.2025 14:20:31; Mounting Type: SMD; Supplier 1: LCSC; Supplier Part Number 1: C122548; Type: Resistor; Live Cycle Status: 1; LCSC Part Number: C122548
R48 = UZgen_R_0402_680R: Generic resistor; Manufacturer: UZgen; Tolerance: 1 %; Created from: UZgenTool; Manufacturer Part Number: UZgen_R_0402_680R; PartID: 73; Created On: 02.07.2024 17:29:46; Value: 680R; Device Package: 0402; Mounting Type: SMD; Last Updated: 02.07.2024 17:29:46
R49 R52 = UZgen_R_0402_10k: as R24 on sheet Power_Supply_1; Manufacturer Part Number: UZgen_R_0402_10k; PartID: 101; Created On: 02.07.2024 17:29:46; Value: 10k; Device Package: 0402; Mounting Type: SMD; Last Updated: 02.07.2024 17:29:46
R50 = UZgen_R_0402_20k: as R23 on sheet Power_Supply_1; Value: 20k; Manufacturer Part Number: UZgen_R_0402_20k; PartID: 108; Created On: 02.07.2024 17:29:46; Device Package: 0402; Last Updated: 02.07.2024 17:29:46; Mounting Type: SMD
R51 = UZgen_R_0402_390R: Generic resistor; Manufacturer: UZgen; Tolerance: 1 %; Created from: UZgenTool; Manufacturer Part Number: UZgen_R_0402_390R; PartID: 67; Created On: 02.07.2024 17:29:46; Value: 390R; Device Package: 0402; Mounting Type: SMD; Last Updated: 02.07.2024 17:29:46
TP8-TP11 = Testpoint_1mm: as TP6 on sheet Power_Supply_1; Created: 2018_06_25_AGeiger; Value: Testpoint 1mm; Manufacturer Part Number: Testpoint_1mm; PartID: 9; Created On: 20.09.2022 13:14:57; Component Type: Testpoint; Last Updated: 14.08.2025 11:47:07; Supplier 1: NULL; Supplier Part Number 1: NULL; Type: Testpoint; Live Cycle Status: 1
U6 = REF2033AIDDCT: REF20xx Low-Drift, Low-Power, Dual-Output, VREF and VREF / 2 Voltage References; Manufacturer: Texas Instruments; Created from: AGeiger; Digikey Part-Number: 296-40487-1-ND; Manufacturer Part Number: REF2033AIDDCT; PartID: 12; Created On: 20.09.2022 16:03:22; ComponentLink1Description: Datasheet; ComponentLink1URL: https://www.ti.com/lit/ds/symlink/ref2033.pdf?HQS=dis-mous-null-mousermode-dsf-pf-null-wwe&ts=1661952535444&ref_url=https%253A%252F%252Fwww.mouser.de%252F; Component Type: Voltage Reference; Device Package: SMD; Last Updated: 20.09.2022 16:03:22; Mounting Type: SMD; Operating Temperature: -40 - 125 °C; Series: REF20xx; Supplier 1: LCSC; Supplier Part Number 1: C181409; Type: Voltage Reference; Value: REF2033, 3.3V and 1.65V; Live Cycle Status: 1; LCSC Part Number: C181409; Stock number: not stored
U9 U11 = TPS7A4901DGNR: 36 V, -150 mA, ultralow-noise, positive linear regulator; Manufacturer: Texas Instruments; Value: -1.194 V - -33 V; Created from: AGeiger; ComponentLink1Description: Datasheet; ComponentLink1URL: https://www.ti.com/lit/ds/symlink/tps7a49.pdf?HQS=dis-mous-null-mousermode-dsf-pf-null-wwe&ts=1629794614893&ref_url=https%253A%252F%252Fwww.mouser.fr%252F; Supplier 1: Mouser; Supplier Part Number 1: 595-TPS7A4901DGNR; Supplier 2: LCSC; Supplier Part Number 2: C16430; Manufacturer Part Number: TPS7A4901DGNR; PartID: 6; Created On: 24.08.2021 11:34:06; Component Type: LDO; Device Package: HVSSOP-8; Last Updated: 11.08.2025 10:14:53; Mounting Type: SMD; Operating Temperature: -40 to +125 °C; Series: TPS7A4901; Type: LDO; Live Cycle Status: 1; Stock number: not stored; LCSC Part Number: C16430

## Sheet Power_Supply_3.SchDoc
size A4; Author: Andreas Geiger; CompanyName: Technische Hochschule Nürnberg Georg Simon Ohm; Organization: UltraZohm; Address1: Kesslerplatz 12; Address2: 90489 Nürnberg; Address3: GERMANY; DocumentNumber: 12; SheetNumber: 12; SheetTotal: 12; Website: www.ultrazohm.com
Used 3 times, as channels U_Power_Supply_2/Vneg_1, U_Power_Supply_2/Vneg_2, U_Power_Supply_2/Vneg_3. Parts and nets are listed once, with the designators drawn on the sheet.
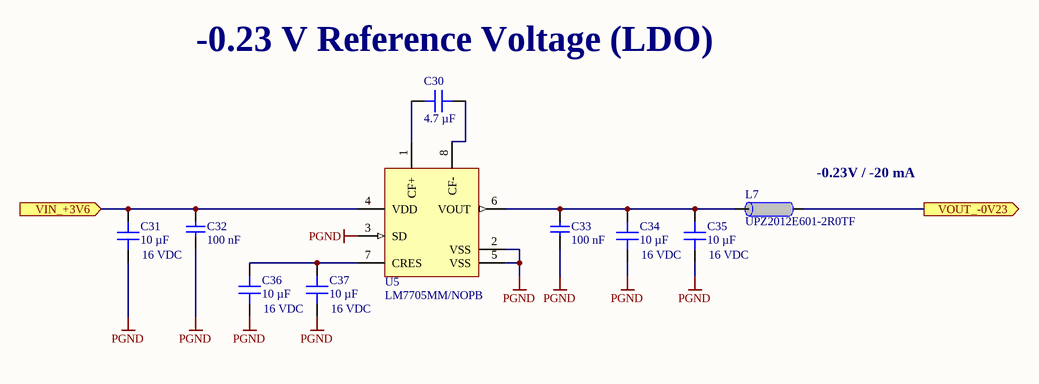
[diagram p11: Power_Supply_3.SchDoc]

### Parts
C30  4.7 µF  [C_0805]
C31  10 µF  Voltage Rating: 16 VDC  [C_0603_TE]
C32  100 nF  [C_0603_TE]
C33  100 nF  [C_0603_TE]
C34  10 µF  Voltage Rating: 16 VDC  [C_0603_TE]
C35  10 µF  Voltage Rating: 16 VDC  [C_0603_TE]
C36  10 µF  Voltage Rating: 16 VDC  [C_0603_TE]
C37  10 µF  Voltage Rating: 16 VDC  [C_0603_TE]
L7  UPZ2012E601-2R0TF  [INDC2012X92N_V]
U5  LM7705MM/NOPB  [MSOP-8_DGK0008A_L]

### Ports
VIN_+3V6 (in), VOUT_-0V23 (out)

### Nets
PGND: C31.1 C32.1 C33.1 C34.1 C35.1 C36.1 C37.1 U5.2(VSS) U5.3(SD) U5.5(VSS)
VIN_+3V6: C31.2 C32.2 U5.4(VDD) ; port VIN_+3V6
VOUT_-0V23: L7.1 ; port VOUT_-0V23
NetC30_1: C30.1 U5.1(CF+)
NetC30_2: C30.2 U5.8(CF-)
NetC33_2: C33.2 C34.2 C35.2 L7.2 U5.6(VOUT)
NetC36_2: C36.2 C37.2 U5.7(CRES)

### Channels
U_Power_Supply_2/Vneg_1: designators end in A; ports VIN_+3V6=+3V6 VOUT_-0V23=Vneg_1
U_Power_Supply_2/Vneg_2: designators end in B; ports VIN_+3V6=+3V6 VOUT_-0V23=Vneg_2
U_Power_Supply_2/Vneg_3: designators end in C; ports VIN_+3V6=+3V6 VOUT_-0V23=Vneg_3

### Notes on the sheet
- (near C30) -0.23 V Reference Voltage (LDO)
- (near L7) -0.23V / -20 mA
- Title
- Revision:
- Design Engineer:
- Date:
- Project:
- Sheet
- of

### Library data of the parts
C30 = CL21A475KAQNNNE: 25V 4.7uF X5R ±10% 0805  Multilayer Ceramic Capacitors MLCC - SMD/SMT ROHS; Manufacturer: Samsung Electro-Mechanics; Voltage Rating: 25 VDC; Created from: AGeiger; Manufacturer Part Number: CL21A475KAQNNNE; PartID: 113; Created On: 20.11.2022 14:23:36; ComponentLink1Description: Datasheet; ComponentLink1URL: https://datasheet.lcsc.com/lcsc/1810261822_Samsung-Electro-Mechanics-CL21A475KAQNNNE_C1779.pdf; Component Type: Capacitor 0805; Device Package: 0805; Last Updated: 20.11.2022 14:23:36; Mounting Type: SMD; Operating Temperature: -55 to +85°C; Series: X5R; Supplier 1: LCSC; Supplier Part Number 1: C1779; Type: Capacitor; Tolerance: 10 %; Value: 4.7 µF; Live Cycle Status: 1; LCSC Part Number: C1779
C31 C34-C37 = CL10A106MO8NQNC: Capacitor 0603, 16 VDC, 10 µF, X5R; Manufacturer: Samsung Electro-Mechanics; Tolerance: 20 %; Created from: AGeiger; Manufacturer Part Number: CL10A106MO8NQNC; PartID: 101; Created On: 22.08.2022 13:56:44; ComponentLink1Description: Datasheet; ComponentLink1URL: https://datasheet.lcsc.com/lcsc/1810261909_Samsung-Electro-Mechanics-CL10A106MO8NQNC_C92487.pdf; Component Type: Capacitor 0603; Device Package: 0603; Last Updated: 19.11.2024 12:34:06; Mounting Type: SMD; Operating Temperature: -55 - 85°C; Supplier 1: LCSC; Supplier Part Number 1: C92487; Type: Capacitor; Value: 10 µF; Live Cycle Status: 1; LCSC Part Number: C92487; Series: X5R
C32 C33 = UZgen_C_0603_100nF_50V_X7R: Generic capacitor; Manufacturer: UZgen; Tolerance: 10 %; Created from: AGeiger; Voltage: 50V; Manufacturer Part Number: UZgen_C_0603_100nF_50V_X7R; PartID: 1; Created On: 02.07.2024 14:42:23; Device Package: 0603; Last Updated: 08.08.2024 15:01:15; Mounting Type: SMD; Value: 100 nF; Technology: X7R
L7 = UPZ2012E601-2R0TF: 2A 1 90mΩ 600Ω@100MHz ±25% 0805  Ferrite Beads ROHS; Manufacturer: Sunlord; Value: 90 Ohm; Created from: AGeiger; Manufacturer Part Number: UPZ2012E601-2R0TF; PartID: 11; Created On: 03.09.2022 16:57:01; ComponentLink1Description: Datasheet; ComponentLink1URL: https://datasheet.lcsc.com/lcsc/2110091730_Sunlord-UPZ2012E601-2R0TF_C98308.pdf; Component Type: Ferrite Beads; Device Package: 0805; Last Updated: 03.09.2022 17:01:04; Mounting Type: SMD; Operating Temperature: -55 - 125 °C; Supplier 1: LCSC; Supplier Part Number 1: C98308; Type: Ferrite Bead; DC current: 2 A; Live Cycle Status: 1; LCSC Part Number: C98308
U5 = LM7705MM/NOPB: Low-Noise Negative Bias Generator; MF: Texas Instruments; OperationTempMin: -40°C; OperationTempMax: +125°C; Value: -0.23V; Created from: AGeiger; ComponentLink1Description: Datasheet; ComponentLink1URL: https://www.ti.com/lit/ds/symlink/lm7705.pdf?ts=1668951598020; Package: VSSOP-8 (DGK0008A); MPN: LM7705MM/NOPB; Manufacturer Part Number: LM7705MM/NOPB; PartID: 22; Created On: 20.11.2022 14:06:38; Component Type: Switched voltage inverter; Device Package: MSOP-8; Last Updated: 20.11.2022 14:06:38; Manufacturer: Texas Instruments; Mounting Type: SMD; Operating Temperature: -40 to +125 °C; Supplier 1: LCSC; Supplier Part Number 1: C129980; Type: Step-down; Live Cycle Status: 1; LCSC Part Number: C129980; Stock number: not stored